# Altium schematic sheet HEADER.SchDoc
size A; SheetNumber: 5; SheetTotal: 5
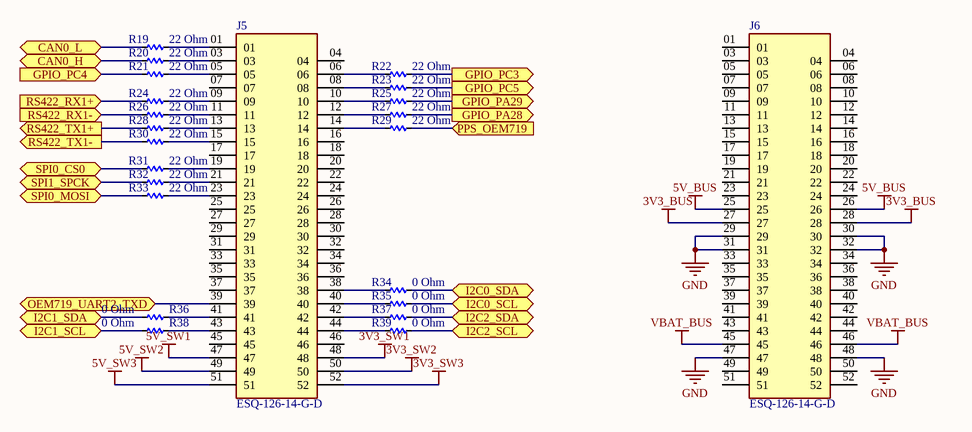
[diagram p0: HEADER.SchDoc]

## Parts
J5  ESQ-126-14-G-D  [ESQ-126-14-G-D]
J6  ESQ-126-14-G-D  [ESQ-126-14-G-D]
R19  22 Ohm  [RES_C_1608X60]
R20  22 Ohm  [RES_C_1608X60]
R21  22 Ohm  [RES_C_1608X60]
R22  22 Ohm  [RES_C_1608X60]
R23  22 Ohm  [RES_C_1608X60]
R24  22 Ohm  [RES_C_1608X60]
R25  22 Ohm  [RES_C_1608X60]
R26  22 Ohm  [RES_C_1608X60]
R27  22 Ohm  [RES_C_1608X60]
R28  22 Ohm  [RES_C_1608X60]
R29  22 Ohm  [RES_C_1608X60]
R30  22 Ohm  [RES_C_1608X60]
R31  22 Ohm  [RES_C_1608X60]
R32  22 Ohm  [RES_C_1608X60]
R33  22 Ohm  [RES_C_1608X60]
R34  0 Ohm  [RES_C_1608X60]
R35  0 Ohm  [RES_C_1608X60]
R36  0 Ohm  [RES_C_1608X60]
R37  0 Ohm  [RES_C_1608X60]
R38  0 Ohm  [RES_C_1608X60]
R39  0 Ohm  [RES_C_1608X60]

## Ports
CAN0_H (bidir), CAN0_L (bidir), GPIO_PA28 (out), GPIO_PA29 (out), GPIO_PC3 (out), GPIO_PC4 (in), GPIO_PC5 (out), I2C0_SCL (bidir), I2C0_SDA (bidir), I2C1_SCL (bidir), I2C1_SDA (bidir), I2C2_SCL (bidir), I2C2_SDA (bidir), OEM719_UART2_TXD (bidir), PPS_OEM719 (in), RS422_RX1+ (in), RS422_RX1- (in), RS422_TX1+ (out), RS422_TX1- (out), SPI0_CS0 (bidir), SPI0_MOSI (bidir), SPI1_SPCK (bidir)

## Nets
3V3_BUS: J6.27 J6.28
3V3_SW1: J5.48
3V3_SW2: J5.50
3V3_SW3: J5.52
5V_BUS: J6.25 J6.26
5V_SW1: J5.47
5V_SW2: J5.49
5V_SW3: J5.51
GND: J6.29 J6.30 J6.31 J6.32 J6.47 J6.48
VBAT_BUS: J6.45 J6.46
CAN0_H: R20.1 ; port CAN0_H
CAN0_L: R19.1 ; port CAN0_L
GPIO_PA28: R27.2 ; port GPIO_PA28
GPIO_PA29: R25.2 ; port GPIO_PA29
GPIO_PC3: R22.2 ; port GPIO_PC3
GPIO_PC4: R21.1 ; port GPIO_PC4
GPIO_PC5: R23.2 ; port GPIO_PC5
I2C0_SCL: R35.2 ; port I2C0_SCL
I2C0_SDA: R34.2 ; port I2C0_SDA
I2C1_SCL: R38.1 ; port I2C1_SCL
I2C1_SDA: R36.1 ; port I2C1_SDA
I2C2_SCL: R39.2 ; port I2C2_SCL
I2C2_SDA: R37.2 ; port I2C2_SDA
OEM719_UART2_TXD: J5.39 ; port OEM719_UART2_TXD
PPS_OEM719: R29.2 ; port PPS_OEM719
RS422_RX1+: R24.1 ; port RS422_RX1+
RS422_RX1-: R26.1 ; port RS422_RX1-
RS422_TX1+: R28.1 ; port RS422_TX1+
RS422_TX1-: R30.1 ; port RS422_TX1-
SPI0_CS0: R31.1 ; port SPI0_CS0
SPI0_MOSI: R33.1 ; port SPI0_MOSI
SPI1_SPCK: R32.1 ; port SPI1_SPCK
NetJ5_01: J5.01 R19.2
NetJ5_03: J5.03 R20.2
NetJ5_05: J5.05 R21.2
NetJ5_06: J5.06 R22.1
NetJ5_08: J5.08 R23.1
NetJ5_09: J5.09 R24.2
NetJ5_10: J5.10 R25.1
NetJ5_11: J5.11 R26.2
NetJ5_12: J5.12 R27.1
NetJ5_13: J5.13 R28.2
NetJ5_14: J5.14 R29.1
NetJ5_15: J5.15 R30.2
NetJ5_19: J5.19 R31.2
NetJ5_21: J5.21 R32.2
NetJ5_23: J5.23 R33.2
NetJ5_38: J5.38 R34.1
NetJ5_40: J5.40 R35.1
NetJ5_41: J5.41 R36.2
NetJ5_42: J5.42 R37.1
NetJ5_43: J5.43 R38.2
NetJ5_44: J5.44 R39.1

Not connected (* = marked no-connect by the designer): J5 04 07 16 17 18 20 22 24 25 26 27 28 29 30 31 32 33 34 35 36 37 45 46; J6 01 03 04 05 06 07 08 09 10 11 12 13 14 15 16 17 18 19 20 21 22 23 24 33 34 35 36 37 38 39 40 41 42 43 44 49 50 51 52

## Library data of the parts
J5 J6 = ESQ-126-14-G-D: PC / 104 Connectors Elevated Socket Strip
R19-R39 = _RES_B_2: RES